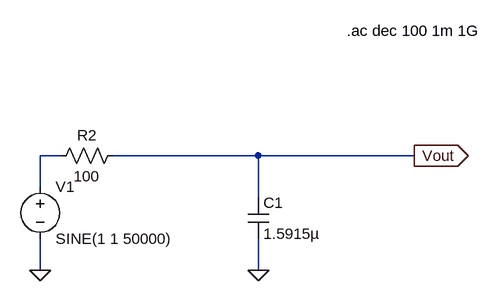
[diagram p0: schematic Draft1.asc]
Draft1.asc, the LTspice schematic file:
Version 4
SHEET 1 968 680
WIRE 320 352 288 352
WIRE 624 352 400 352
WIRE 864 352 624 352
WIRE 288 400 288 352
WIRE 624 416 624 352
WIRE 288 528 288 480
WIRE 624 528 624 480
FLAG 288 528 0
FLAG 864 352 Vout
IOPIN 864 352 Out
FLAG 624 528 0
SYMBOL res 416 336 R90
WINDOW 0 0 56 VBottom 2
WINDOW 3 32 56 VTop 2
SYMATTR InstName R2
SYMATTR Value 100
SYMBOL voltage 288 384 R0
SYMATTR InstName V1
SYMATTR Value SINE(1 1 50000)
SYMATTR Value2 AC 1
SYMBOL cap 608 416 R0
SYMATTR InstName C1
SYMATTR Value 1.5915µ
TEXT 760 160 Left 2 !.ac dec 100 1m 1G

The netlist it stands for:
* Draft1.asc
R2 Vout N001 100
V1 N001 0 SINE(1 1 50000) AC 1
C1 Vout 0 1.5915µ
.ac dec 100 1m 1G
.backanno
.end

* Results of the author's LTspice run, read from the files saved beside the schematic
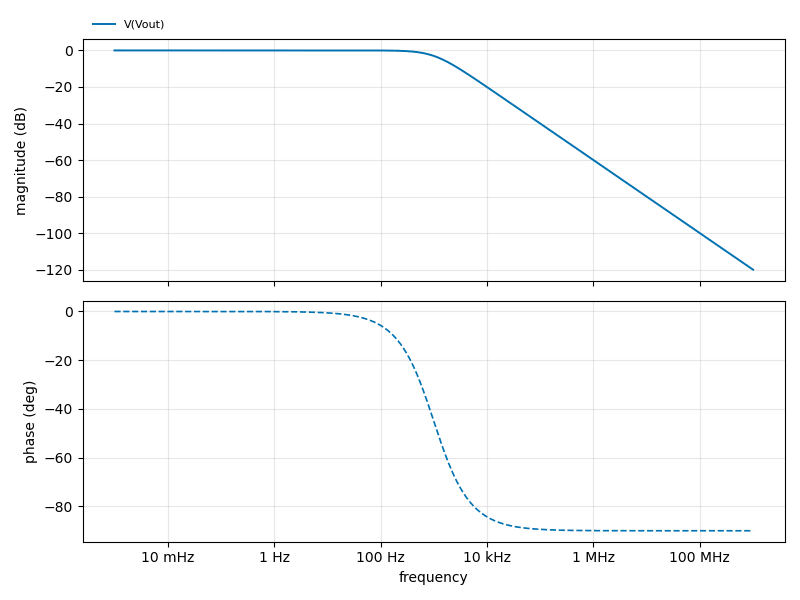
[diagram p1: AC Analysis of Draft1.asc, plotted from the saved traces]
* AC Analysis, 1 run:
*   V(Vout): -0.00 dB at 1 mHz, -120.00 dB at 1 GHz, peak -0.00 dB at 1 mHz, 3 dB below the peak at 1 kHz